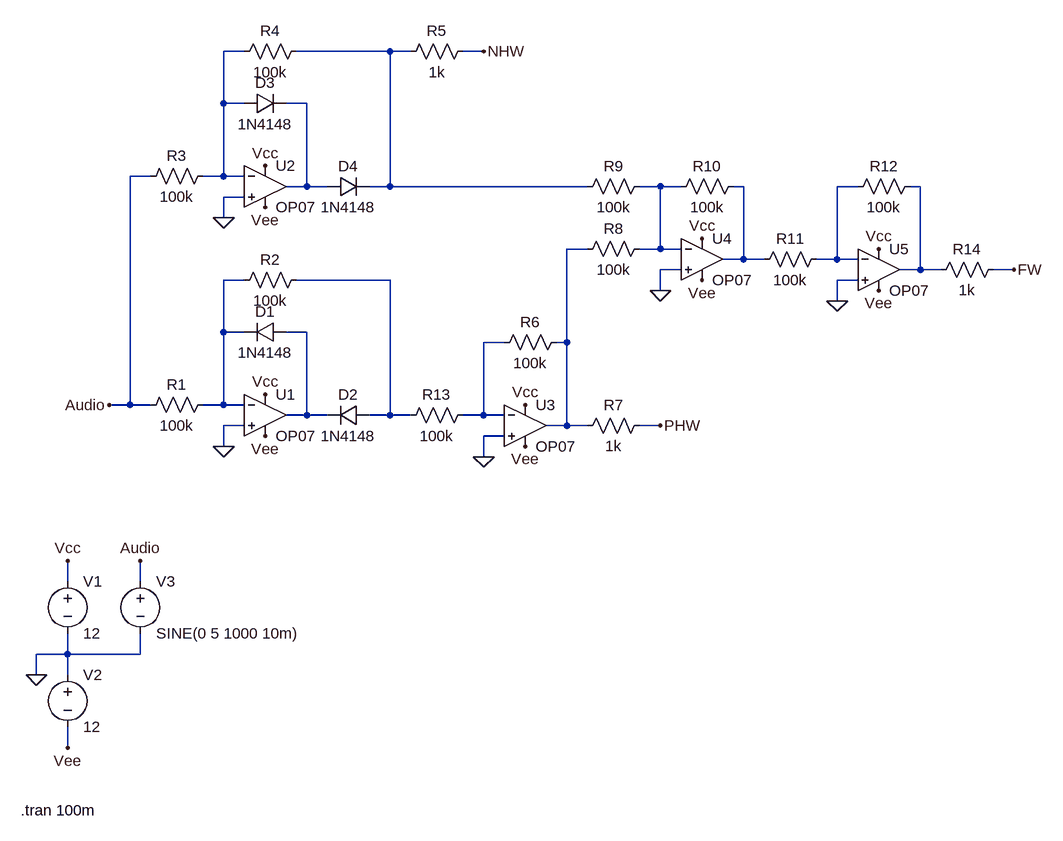
[diagram p0: schematic Rectifier.asc]
Rectifier.asc, the LTspice schematic file:
Version 4
SHEET 1 2524 680
WIRE 240 -752 208 -752
WIRE 464 -752 320 -752
WIRE 496 -752 464 -752
WIRE 608 -752 576 -752
WIRE 208 -672 208 -752
WIRE 240 -672 208 -672
WIRE 336 -672 304 -672
WIRE 96 -560 64 -560
WIRE 208 -560 208 -672
WIRE 208 -560 176 -560
WIRE 240 -560 208 -560
WIRE 336 -544 336 -672
WIRE 336 -544 304 -544
WIRE 368 -544 336 -544
WIRE 464 -544 464 -752
WIRE 464 -544 432 -544
WIRE 768 -544 464 -544
WIRE 880 -544 848 -544
WIRE 912 -544 880 -544
WIRE 1008 -544 992 -544
WIRE 1184 -544 1152 -544
WIRE 1280 -544 1264 -544
WIRE 240 -528 208 -528
WIRE 208 -496 208 -528
WIRE 768 -448 736 -448
WIRE 880 -448 880 -544
WIRE 880 -448 848 -448
WIRE 912 -448 880 -448
WIRE 1008 -432 1008 -544
WIRE 1008 -432 976 -432
WIRE 1040 -432 1008 -432
WIRE 1152 -432 1152 -544
WIRE 1152 -432 1120 -432
WIRE 1184 -432 1152 -432
WIRE 912 -416 880 -416
WIRE 1280 -416 1280 -544
WIRE 1280 -416 1248 -416
WIRE 1312 -416 1280 -416
WIRE 1424 -416 1392 -416
WIRE 240 -400 208 -400
WIRE 464 -400 320 -400
WIRE 1184 -400 1152 -400
WIRE 880 -384 880 -416
WIRE 1152 -368 1152 -400
WIRE 208 -320 208 -400
WIRE 240 -320 208 -320
WIRE 336 -320 304 -320
WIRE 640 -304 608 -304
WIRE 736 -304 736 -448
WIRE 736 -304 720 -304
WIRE 64 -208 64 -560
WIRE 64 -208 32 -208
WIRE 96 -208 64 -208
WIRE 208 -208 208 -320
WIRE 208 -208 176 -208
WIRE 240 -208 208 -208
WIRE 336 -192 336 -320
WIRE 336 -192 304 -192
WIRE 368 -192 336 -192
WIRE 464 -192 464 -400
WIRE 464 -192 432 -192
WIRE 496 -192 464 -192
WIRE 608 -192 608 -304
WIRE 608 -192 576 -192
WIRE 640 -192 608 -192
WIRE 240 -176 208 -176
WIRE 736 -176 736 -304
WIRE 736 -176 704 -176
WIRE 768 -176 736 -176
WIRE 880 -176 848 -176
WIRE 640 -160 608 -160
WIRE 208 -144 208 -176
WIRE 608 -128 608 -160
WIRE -32 64 -32 32
WIRE 80 64 80 32
WIRE -32 176 -32 144
WIRE -32 176 -80 176
WIRE 80 176 80 144
WIRE 80 176 -32 176
WIRE -80 208 -80 176
WIRE -32 208 -32 176
WIRE -32 320 -32 288
FLAG -32 320 Vee
FLAG -32 32 Vcc
FLAG -80 208 0
FLAG 80 32 Audio
FLAG 32 -208 Audio
FLAG 880 -176 PHW
FLAG 272 -224 Vcc
FLAG 272 -160 Vee
FLAG 208 -144 0
FLAG 272 -576 Vcc
FLAG 272 -512 Vee
FLAG 208 -496 0
FLAG 608 -752 NHW
FLAG 672 -208 Vcc
FLAG 672 -144 Vee
FLAG 608 -128 0
FLAG 944 -464 Vcc
FLAG 944 -400 Vee
FLAG 880 -384 0
FLAG 1216 -448 Vcc
FLAG 1216 -384 Vee
FLAG 1152 -368 0
FLAG 1424 -416 FW
SYMBOL voltage -32 48 R0
SYMATTR InstName V1
SYMATTR Value 12
SYMBOL voltage -32 192 R0
SYMATTR InstName V2
SYMATTR Value 12
SYMBOL voltage 80 48 R0
WINDOW 123 0 0 Left 0
WINDOW 39 0 0 Left 0
SYMATTR InstName V3
SYMATTR Value SINE(0 5 1000 10m)
SYMBOL res 192 -224 R90
WINDOW 0 0 56 VBottom 2
WINDOW 3 32 56 VTop 2
SYMATTR InstName R1
SYMATTR Value 100k
SYMBOL res 592 -208 R90
WINDOW 0 0 56 VBottom 2
WINDOW 3 32 56 VTop 2
SYMATTR InstName R13
SYMATTR Value 100k
SYMBOL diode 304 -304 M270
WINDOW 0 32 32 VTop 2
WINDOW 3 0 32 VBottom 2
SYMATTR InstName D1
SYMATTR Value 1N4148
SYMBOL res 336 -416 R90
WINDOW 0 0 56 VBottom 2
WINDOW 3 32 56 VTop 2
SYMATTR InstName R2
SYMATTR Value 100k
SYMBOL diode 432 -176 M270
WINDOW 0 32 32 VTop 2
WINDOW 3 0 32 VBottom 2
SYMATTR InstName D2
SYMATTR Value 1N4148
SYMBOL Opamps\\OP07 272 -256 R0
SYMATTR InstName U1
SYMBOL res 192 -576 R90
WINDOW 0 0 56 VBottom 2
WINDOW 3 32 56 VTop 2
SYMATTR InstName R3
SYMATTR Value 100k
SYMBOL diode 240 -656 R270
WINDOW 0 32 32 VTop 2
WINDOW 3 0 32 VBottom 2
SYMATTR InstName D3
SYMATTR Value 1N4148
SYMBOL res 336 -768 R90
WINDOW 0 0 56 VBottom 2
WINDOW 3 32 56 VTop 2
SYMATTR InstName R4
SYMATTR Value 100k
SYMBOL diode 368 -528 R270
WINDOW 0 32 32 VTop 2
WINDOW 3 0 32 VBottom 2
SYMATTR InstName D4
SYMATTR Value 1N4148
SYMBOL Opamps\\OP07 272 -608 R0
SYMATTR InstName U2
SYMBOL res 592 -768 R90
WINDOW 0 0 56 VBottom 2
WINDOW 3 32 56 VTop 2
SYMATTR InstName R5
SYMATTR Value 1k
SYMBOL Opamps\\OP07 672 -240 R0
SYMATTR InstName U3
SYMBOL res 736 -320 R90
WINDOW 0 0 56 VBottom 2
WINDOW 3 32 56 VTop 2
SYMATTR InstName R6
SYMATTR Value 100k
SYMBOL res 864 -192 R90
WINDOW 0 0 56 VBottom 2
WINDOW 3 32 56 VTop 2
SYMATTR InstName R7
SYMATTR Value 1k
SYMBOL res 864 -464 R90
WINDOW 0 0 56 VBottom 2
WINDOW 3 32 56 VTop 2
SYMATTR InstName R8
SYMATTR Value 100k
SYMBOL res 864 -560 R90
WINDOW 0 0 56 VBottom 2
WINDOW 3 32 56 VTop 2
SYMATTR InstName R9
SYMATTR Value 100k
SYMBOL Opamps\\OP07 944 -496 R0
SYMATTR InstName U4
SYMBOL res 1008 -560 R90
WINDOW 0 0 56 VBottom 2
WINDOW 3 32 56 VTop 2
SYMATTR InstName R10
SYMATTR Value 100k
SYMBOL res 1136 -448 R90
WINDOW 0 0 56 VBottom 2
WINDOW 3 32 56 VTop 2
SYMATTR InstName R11
SYMATTR Value 100k
SYMBOL Opamps\\OP07 1216 -480 R0
SYMATTR InstName U5
SYMBOL res 1280 -560 R90
WINDOW 0 0 56 VBottom 2
WINDOW 3 32 56 VTop 2
SYMATTR InstName R12
SYMATTR Value 100k
SYMBOL res 1408 -432 R90
WINDOW 0 0 56 VBottom 2
WINDOW 3 32 56 VTop 2
SYMATTR InstName R14
SYMATTR Value 1k
TEXT -104 416 Left 2 !.tran 100m

The netlist it stands for:
* Rectifier.asc
V1 Vcc 0 12
V2 0 Vee 12
V3 Audio 0 SINE(0 5 1000 10m)
R1 N009 Audio 100k
R13 N012 N010 100k
D1 N011 N009 1N4148
R2 N010 N009 100k
D2 N010 N011 1N4148
XU1 0 N009 Vcc Vee N011 LT1001  ; OP07, pins In+ In- V+ V- OUT
R3 N001 Audio 100k
D3 N001 N003 1N4148
R4 N002 N001 100k
D4 N003 N002 1N4148
XU2 0 N001 Vcc Vee N003 LT1001  ; OP07, pins In+ In- V+ V- OUT
R5 NHW N002 1k
XU3 0 N012 Vcc Vee N008 LT1001  ; OP07, pins In+ In- V+ V- OUT
R6 N008 N012 100k
R7 PHW N008 1k
R8 N004 N008 100k
R9 N004 N002 100k
XU4 0 N004 Vcc Vee N005 LT1001  ; OP07, pins In+ In- V+ V- OUT
R10 N005 N004 100k
R11 N006 N005 100k
XU5 0 N006 Vcc Vee N007 LT1001  ; OP07, pins In+ In- V+ V- OUT
R12 N007 N006 100k
R14 FW N007 1k
.model D D
.lib standard.dio
.tran 100m
.lib LTC.lib
.backanno
.end